# Altium schematic sheet Power.SchDoc: Power and Circuit Prot
size Letter; Date: Jul 31/2018; Revision: 1; SheetNumber: 1; SheetTotal: 9
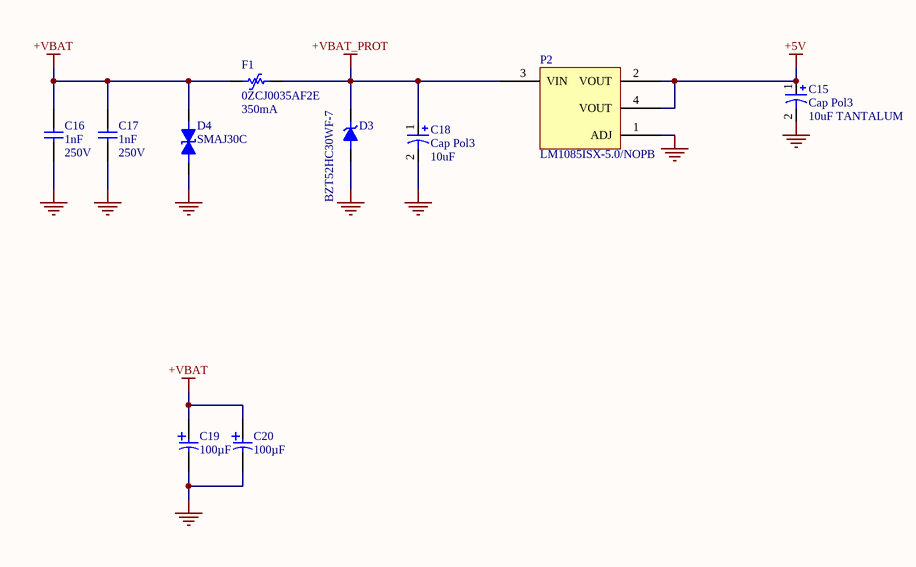
[diagram p0: Power.SchDoc]

## Parts
C15  Cap Pol3  value 10uF TANTALUM  [1206-Polarized]
C16  value 1nF  Voltage: 250V  [1206]  (hidden comment: CAP 1nF ±10% 250V 0805 X7R)
C17  value 1nF  Voltage: 250V  [1206]  (hidden comment: CAP 1nF ±10% 250V 0805 X7R)
C18  Cap Pol3  value 10uF  [1206-Polarized]
C19  value 100µF  [CAPAE7066X80M]  (hidden comment: EEE-FK1V101XP)
C20  value 100µF  [CAPAE7066X80M]  (hidden comment: EEE-FK1V101XP)
D3  BZT52HC30WF-7  [SODFL340X115-2N]
D4  SMAJ30C  [SON127P500X135-2N]
F1  0ZCJ0035AF2E  value 350mA  [0ZCJ-1206-0.9]
P2  LM1085ISX-5.0/NOPB  [TO-263]

## Nets
+5V: C15.1 P2.2(VOUT) P2.4(VOUT)
+VBAT: C16.1 C17.1 C19.2 C20.2 D4.1 F1.1
+VBAT_PROT: C18.1 D3.1(K) F1.2 P2.3(VIN)
GND: C15.2 C16.2 C17.2 C18.2 C19.1 C20.1 D3.2(A) D4.2 P2.1(ADJ)

## Notes on the sheet
- Date:
- Revision:
- Sheet:
- /

## Library data of the parts
C15 C18 = Cap Pol3: Polarized Capacitor (Surface Mount); Published: 8-Jun-2000; LatestRevisionDate: 29-May-2009; LatestRevisionNote: IPC-7351 Footprint Added.; PackageReference: C0805; Publisher: Altium Limited; PackageDescription: Chip Capacitor
C16 C17 = CC0805KRX7RYBB102: Manufacturer: Yageo; Manufacturer Series: CC; Part Number: CC0805KRX7RYBB102; Component Type: Standard; Tolerance: ±10%; Package: 0805; Temperature Coefficient: X7R; Temperature Range: -55°C ~ 125°C; Supplier 1: Digi-Key; Supplier Part Number 1: 311-1470-1-ND
C19 C20 = EEE-FK1V101XP: Supplier 1: Digi-Key; Supplier Part Number 1: PCE3836CT-ND
D3 = BZT52HC30WF-7: Supplier 1: Digi-Key; Supplier Part Number 1: BZT52HC30WF-7DICT-ND